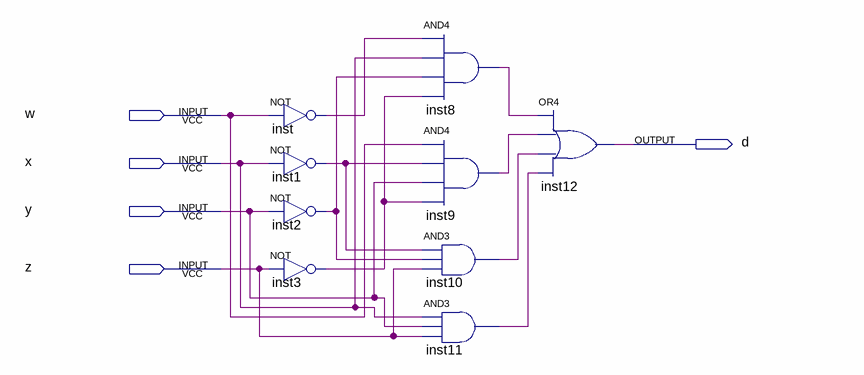
[diagram p0: schematic sheet]
// Quartus schematic D.bdf as structural Verilog: 9 symbols, 5 pins
module D (
  input  w,
  input  x,
  input  y,
  input  z,
  output d
);

  wire inst1_out, inst2_out, inst3_out, inst8_out, inst9_out, inst10_out, inst11_out, inst_out;

  not inst (inst_out, w);
  not inst1 (inst1_out, x);
  not inst2 (inst2_out, y);
  not inst3 (inst3_out, z);
  and inst8 (inst8_out, inst_out, x, inst2_out, inst3_out);
  and inst9 (inst9_out, w, inst1_out, y, inst3_out);
  and inst10 (inst10_out, inst1_out, inst2_out, z);
  and inst11 (inst11_out, x, y, z);
  or inst12 (d, inst8_out, inst9_out, inst10_out, inst11_out);
endmodule
